# Altium schematic sheet EthernetSheet.SchDoc
size B; SheetNumber: 13; SheetTotal: 14
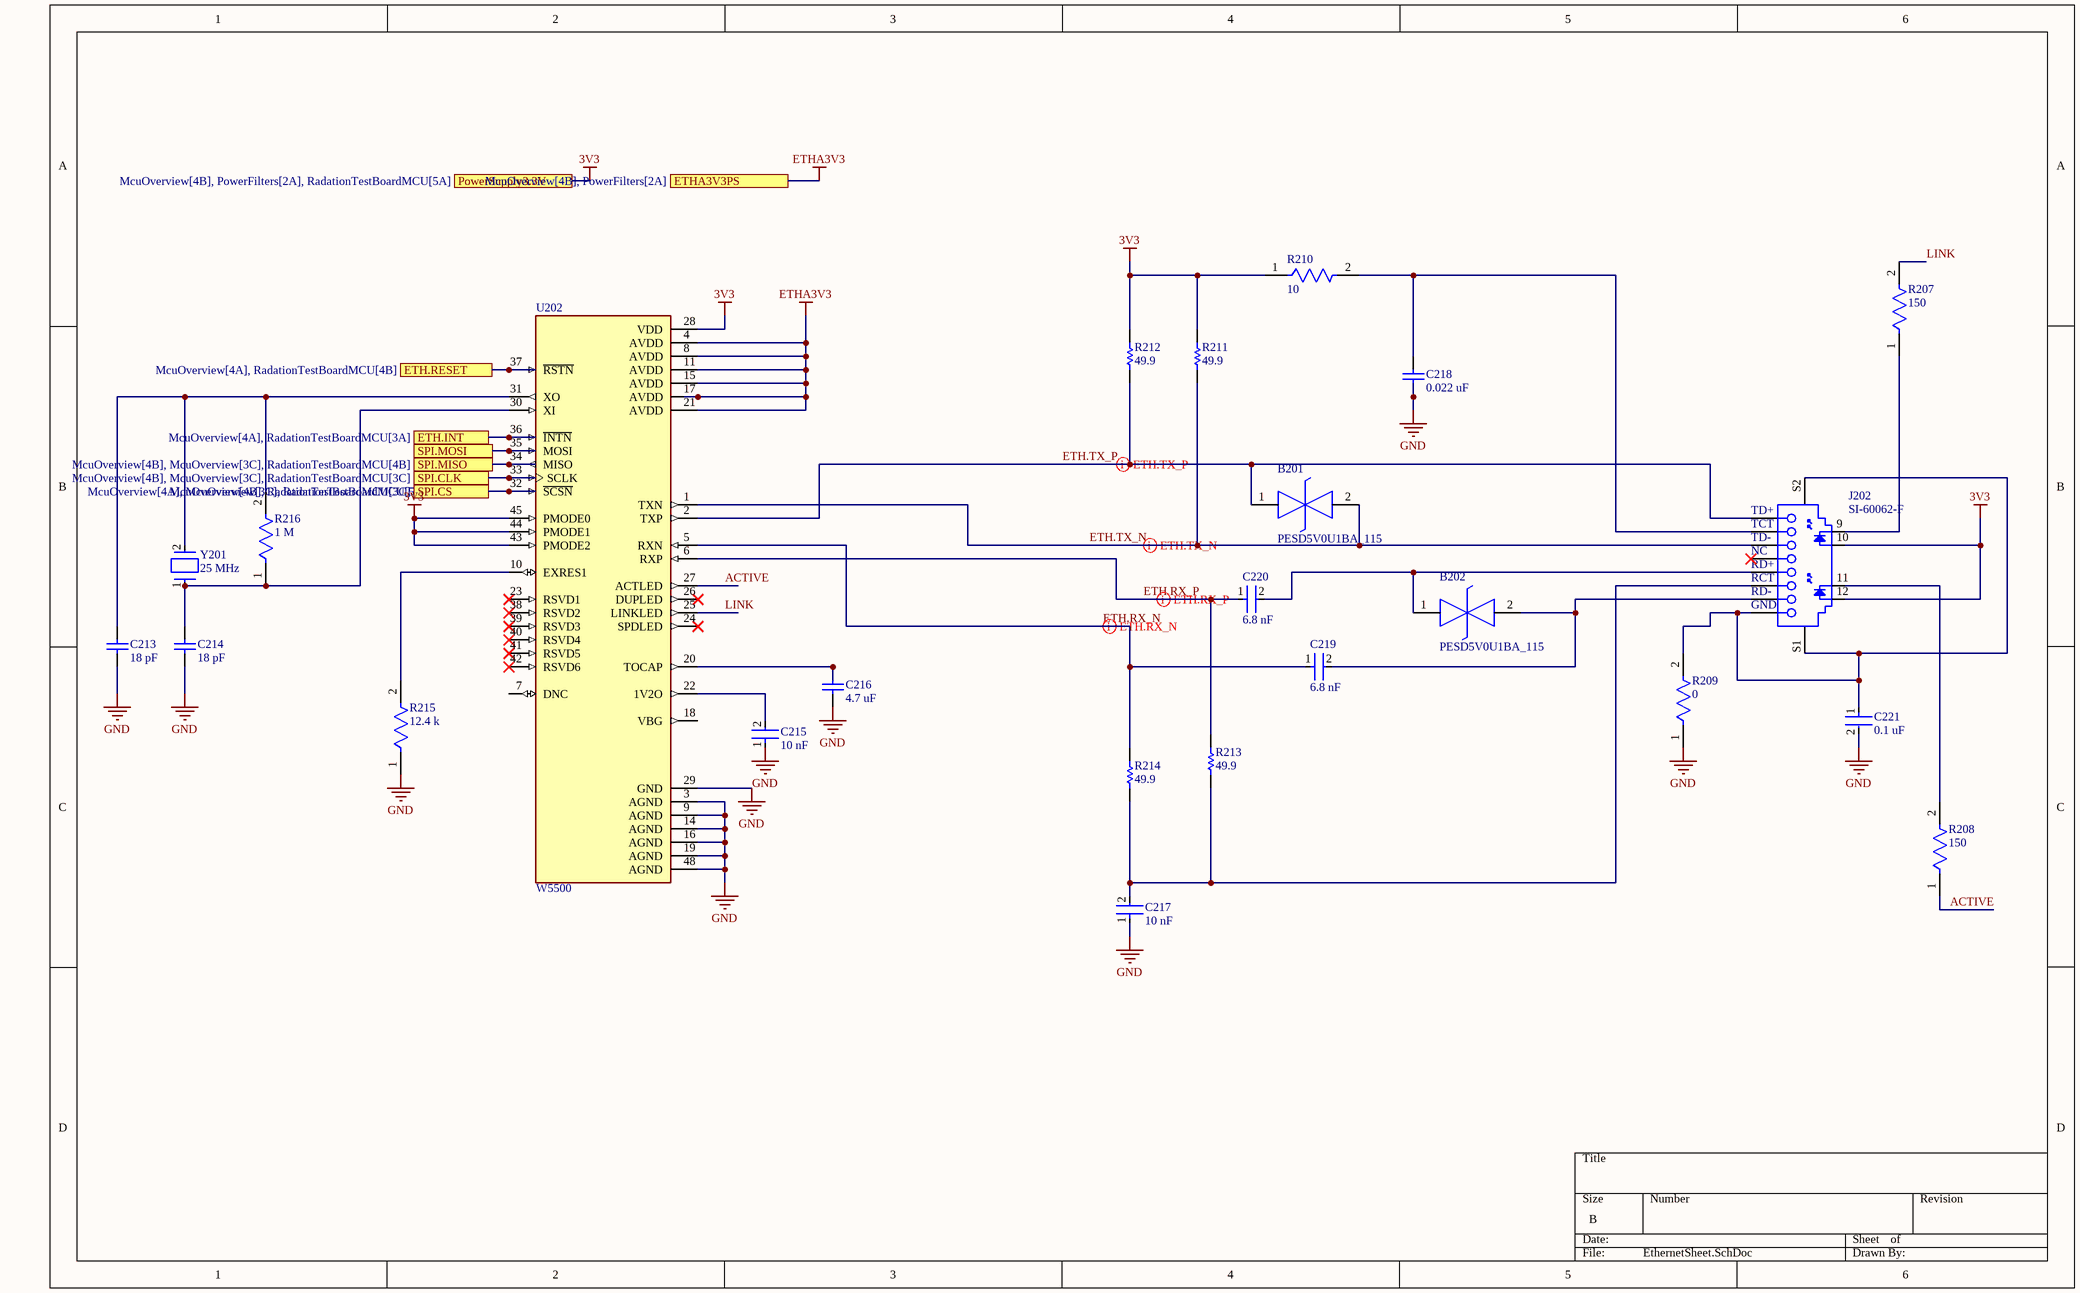
[diagram p0: EthernetSheet.SchDoc]

## Parts
B201  PESD5V0U1BA_115  [PESD5V0U1BA115]
B202  PESD5V0U1BA_115  [PESD5V0U1BA115]
C213  18 pF  [CAPC1608X90X35LL15T15]
C214  18 pF  [CAPC1608X90X35LL15T15]
C215  10 nF  [FP-0603-L_1_6_0_15-W_0_81-IPC_C]
C216  4.7 uF  [CAPC1608X87X35NL15T15]
C217  10 nF  [FP-0603-L_1_6_0_15-W_0_81-IPC_C]
C218  0.022 uF  [CAPC1608X92X38LL15T08]
C219  6.8 nF  [FP-CGA3E-0_3-0_1-IPC_A]
C220  6.8 nF  [FP-CGA3E-0_3-0_1-IPC_A]
C221  0.1 uF  [FP-CC0603-DA-IPC_A]
J202  SI-60062-F  [BELF-SI-60062-F_V]
R207  150  [FP-CRCW0603-e3-MFG]
R208  150  [FP-CRCW0603-e3-MFG]
R209  0  [FP-CRCW0402-e3-IPC_C]
R210  10  [FP-CRCW0603-e3-IPC_A]
R211  49.9  [RESC1609X50X30NL10T20]
R212  49.9  [RESC1609X50X30NL10T20]
R213  49.9  [RESC1609X50X30NL10T20]
R214  49.9  [RESC1609X50X30NL10T20]
R215  12.4 k  [FP-CRCW0603-e3-IPC_B]
R216  1 M  [FP-ERJ3EK-IPC_C]
U202  W5500  [QFP50P900X900X160-48N]
Y201  25 MHz  [FP-ABM3-MFG]

## Ports
ETH.INT (see McuOverview[4A], RadationTestBoardMCU[3A]), ETH.RESET (see McuOverview[4A], RadationTestBoardMCU[4B]), ETHA3V3PS (see McuOverview[4B], PowerFilters[2A]), PowerSupply3.3V (see McuOverview[4B], PowerFilters[2A], RadationTestBoardMCU[5A]), SPI.CLK (see McuOverview[4B], McuOverview[3C], RadationTestBoardMCU[3C]), SPI.CS (see McuOverview[4B], RadationTestBoardMCU[3C]), SPI.MISO (see McuOverview[4B], McuOverview[3C], RadationTestBoardMCU[4B]), SPI.MOSI (see McuOverview[4A], McuOverview[3C], RadationTestBoardMCU[5B])

## Nets
3V3: J202.10 J202.12 R210.1 R211.2 R212.2 U202.28(VDD) U202.43(PMODE2) U202.44(PMODE1) U202.45(PMODE0) ; port PowerSupply3.3V
ETHA3V3: U202.4(AVDD) U202.8(AVDD) U202.11(AVDD) U202.15(AVDD) U202.17(AVDD) U202.21(AVDD) ; port ETHA3V3PS
GND: C213.2 C214.1 C215.1 C216.1 C217.1 C218.1 C221.2 R209.1 R215.1 U202.3(AGND) U202.9(AGND) U202.14(AGND) U202.16(AGND) U202.19(AGND) U202.29(GND) U202.48(AGND)
ACTIVE: R208.1 U202.27(ACTLED)
ETH.INT: U202.36(~{INTN}) ; port ETH.INT
ETH.RESET: U202.37(~{RSTN}) ; port ETH.RESET
ETH.RX_N: C219.1 R214.2 U202.5(RXN)
ETH.RX_P: C220.1 R213.2 U202.6(RXP)
ETH.TX_N: B201.2(K2) J202.3(TD-) R211.1 U202.1(TXN)
ETH.TX_P: B201.1(K1) J202.1(TD+) R212.1 U202.2(TXP)
LINK: R207.2 U202.25(LINKLED)
SPI.CLK: U202.33(SCLK) ; port SPI.CLK
SPI.CS: U202.32(~{SCSN}) ; port SPI.CS
SPI.MISO: U202.34(MISO) ; port SPI.MISO
SPI.MOSI: U202.35(MOSI) ; port SPI.MOSI
NetB202_1: B202.1(K1) C220.2 J202.5(RD+)
NetB202_2: B202.2(K2) C219.2 J202.7(RD-)
NetC213_1: C213.1 R216.2 U202.31(XO) Y201.2
NetC214_2: C214.2 R216.1 U202.30(XI) Y201.1
NetC215_2: C215.2 U202.22(1V2O)
NetC216_2: C216.2 U202.20(TOCAP)
NetC217_2: C217.2 J202.6(RCT) R213.1 R214.1
NetC218_2: C218.2 J202.2(TCT) R210.2
NetC221_1: C221.1 J202.8(GND) J202.S1 J202.S2 R209.2
NetJ202_9: J202.9 R207.1
NetJ202_11: J202.11 R208.2
NetR215_2: R215.2 U202.10(EXRES1)

Not connected (* = marked no-connect by the designer): J202 4(NC)*; U202 7(DNC) 18(VBG) 23(RSVD1)* 24(SPDLED)* 26(DUPLED)* 38(RSVD2)* 39(RSVD3)* 40(RSVD4)* 41(RSVD5)* 42(RSVD6)*

## Layout directives
differential pair: ETH.RX_N, ETH.RX_P, ETH.TX_N, ETH.TX_P

## Library data of the parts
B201 B202 = PESD5V0U1BA_115: PESDV0U1BA - Low capacitance bidirectional ESD protection diode; Manufacturer_Name: Nexperia; Manufacturer_Part_Number: PESD5V0U1BA,115; Geometry.Height: 1.1mm; Mouser Part Number: 771-PESD5V0U1BA115; Mouser Price/Stock: https://www.mouser.co.uk/ProductDetail/Nexperia/PESD5V0U1BA115?qs=LOCUfHb8d9tqw6h%2FD3HZHw%3D%3D; Datasheet Link: https://assets.nexperia.com/documents/data-sheet/PESD5V0U1BA.pdf
C213 C214 = CMP-2006-04592-1: 06035A180FAT2A; Manufacturer: AVX Interconnect / Elco; Part Number: 06035A180FAT2A
C215 C217 = CMP-2006-02076-2: CAP CER 10000PF 50V X7R 0603 06035C103KAT4A; Insulation Resistance: 100GR; Tolerance: 10%; Dissipation Factor: 2.5%; Capacitance: 10nF; Number of Pins: 2; Package Quantity: 15000; Voltage Rating (DC): 50V; Case Code (Imperial): 0603; Series: -; Depth: 0.81mm; Termination: SMD/SMT; Packaging: Tape and Reel; Length: 1.6mm; Radiation Hardening: No; REACH SVHC: No SVHC; Height: 0.9mm; Min Operating Temperature: -55°C; Voltage Rating: 50V; RoHS Compliant: Yes; Case Code (Metric): 1608; Width: 0.81mm; Lead Free: Lead Free; Construction: Flat; Case/Package: 0603; Voltage: 50V; Dielectric: X7R; Max Operating Temperature: 125°C; Mount: Surface Mount
C216 = CMP-2006-03238-1: C0603C475K8PACTU; Manufacturer: Kemet; Part Number: C0603C475K8PACTU
C218 = CMP-2006-01328-1: VJ0603Y223JXAAC; Manufacturer: Vitramon; Part Number: VJ0603Y223JXAAC
C219 C220 = CMP-08246-001772-1: Cap Ceramic 6.8nF 50V C0G 5% Pad SMD 0603 +125°C Automotive T/R CGA3E2C0G1H682J080AE
C221 = CMP-03422-001490-1: CAP CER 0.1UF 50V X7R 0603 CC0603JRX7R9BB104; Capacitance: 100nF; Tolerance: 5%; Number of Pins: 2; Depth: 0.8mm; Weight: 7.1E-05oz; Radiation Hardening: No; Case Code (Metric): 1608; Dielectric: X7R; Max Operating Temperature: 125°C; Voltage Rating (DC): 50V; Case/Package: 0603; Halogen Free: Halogen Free; Mount: Surface Mount; Lead Free: Lead Free; Termination: SMD/SMT; RoHS Compliant: Yes; Length: 1.6mm; Series: CC; Resistor Type: Ceramic; Case Code (Imperial): 0603; Construction: Flat; Width: 0.031inch; Height: 0.8mm; Voltage Rating: 50V; Min Operating Temperature: -55°C; Thickness: 0.035inch; Packaging: Tape and Reel
J202 = CMP-2000-07059-1: 1 Port RJ45 Magjack Connector with Yellow and Green LED, 10/100 Base-T, 12-Pin THD, RoHS, Tray; Manufacturer: Bel Fuse; Number of Ways: 8P4C; Gender: Female; Shield Type: STP; Connector Type: RJ45; Contact Plating: Gold; Mounting Type: ThroughHole; Datasheet Version: Rev. B0, 09/2008; Package Reference: SI-60062-F; Manufacturer URL: http://belfuse.com/; Package Description: 12-Pin Through Hole Device, Body 21.59 x 16.13 mm; Series: MagJack; Contact Material: CopperAlloy; Datasheet URL: http://belfuse.com/pdfs/SI-60062-F.pdf; Width: 17.98mm; Length: 15.21mm; Mounting Technology: ThroughHole; Depth: 21.59mm; Orientation: Straight
R207 R208 = CMP-2000-03913-2: RES Thick Film, 150Ω, 1%, 0.1W, 100ppm/°C, 0603 CRCW0603150RFKEA; Voltage Rating (DC): 75V; Resistance: 150R; Max Power Dissipation: 100mW; Features: Automotive AEC-Q200; Weight: 7.1E-05oz; Number of Terminations: 2; Temperature Coefficient: 100ppm/°C; Military Standard: Not; Length: 1.55mm; Min Operating Temperature: -55°C; Termination: SMD/SMT; Tolerance: 1%; Composition: Thick Film; Depth: 0.85mm; Max Operating Temperature: 155°C; Width: 0.033inch; Lead Free: Lead Free; Height: 0.45mm; Case Code (Metric): 1608; Package Quantity: 10; Case Code (Imperial): 0603; Voltage Rating: 75V; Radiation Hardening: No; Contact Plating: Tin; Mount: Surface Mount; Packaging: Tape and Reel; Power Rating: 100mW; Case/Package: 0603
R209 = CMP-2002-08122-2: RES Thick Film, 0Ω, 0.063W, 0402 CRCW04020000Z0ED; Tolerance: 5%; Max Power Dissipation: 63mW; Voltage Rating: 50V; Temperature Coefficient: 100ppm/°C; Resistance: 0mR; Contact Plating: Tin; Height: 0.35mm; Radiation Hardening: No; Features: Automotive AEC-Q200; Composition: Thick Film; Width: 0.5mm; Weight: 2.3E-05oz; Termination: SMD/SMT; Packaging: Tape and Reel; Mount: Surface Mount; Case Code (Metric): 1005; Military Standard: Not; Min Operating Temperature: -55°C; Number of Terminations: 2; Package Quantity: 1; Case Code (Imperial): 0402; Depth: 0.5mm; Max Operating Temperature: 155°C; Case/Package: 0402; Power Rating: 63mW; Lead Free: Lead Free; Voltage Rating (DC): 50V; Length: 1mm
R210 = CMP-2000-03845-2: RES Thick Film, 10Ω, 1%, 0.1W, 100ppm/°C, 0603 CRCW060310R0FKEA; Resistance: 10R; Voltage Rating (DC): 75V; Power Rating: 100mW; Depth: 0.85mm; Height: 0.45mm; Package Quantity: 10; Temperature Coefficient: 100ppm/°C; Weight: 7.1E-05oz; Case Code (Metric): 1608; Number of Terminations: 2; Features: Automotive AEC-Q200; Termination: SMD/SMT; Lead Free: Lead Free; Mount: Surface Mount; Number of Pins: 2; Tolerance: 1%; Max Power Dissipation: 100mW; Width: 0.033inch; Contact Plating: Tin; Case Code (Imperial): 0603; Max Operating Temperature: 155°C; Min Operating Temperature: -55°C; Voltage Rating: 75V; Length: 1.55mm; Case/Package: 0603; Composition: Thick Film; Packaging: Tape and Reel; Military Standard: Not
R211-R214 = CMP-2000-03399-1: CRCW060349R9FKEC 0603 49.9 ohm Resistor; Manufacturer: Vishay Dale; Part Number: CRCW060349R9FKEC
R215 = CMP-2000-03881-2: RES Thick Film, 12.4kΩ, 1%, 0.1W, 100ppm/°C, 0603 CRCW060312K4FKEA; Voltage Rating (DC): 75V; Resistance: 12.4kR; Power Rating: 100mW; Case Code (Metric): 1608; Contact Plating: Tin; Radiation Hardening: No; Packaging: Tape and Reel; Lead Free: Lead Free; Length: 1.55mm; Depth: 0.85mm; Width: 0.85mm; Package Quantity: 10; Composition: Thick Film; Number of Terminations: 2; Max Operating Temperature: 155°C; Min Operating Temperature: -55°C; Height: 0.45mm; Tolerance: 1%; Temperature Coefficient: 100ppm/°C; Number of Pins: 2; Case Code (Imperial): 0603; Features: Automotive AEC-Q200; Weight: 7.1E-05oz; Max Power Dissipation: 100mW; Voltage Rating: 75V; Military Standard: Not; Termination: SMD/SMT; Mount: Surface Mount; Case/Package: 0603
R216 = CMP-1012-00849-3: RES SMD 1M OHM 1% 1/10W 0603 ERJ-3EKF1004V; Resistance: 1MR; Voltage Rating: 75V; Temperature Coefficient: 100ppm/°C; Power Rating: 100mW; REACH SVHC: No SVHC; Radiation Hardening: No; Features: Automotive AEC-Q200; Case Code (Metric): 1608; Resistance Tolerance: 1%; Case/Package: 0603; Termination: SMD/SMT; Max Operating Temperature: 155°C; Tolerance: 1%; Size Code: 0603; Case Code (Imperial): 0603; Min Operating Temperature: -55°C; Number of Pins: 2; Mount: Surface Mount; Package Quantity: 1; Military Standard: Not; Voltage Rating (DC): 75V; Depth: 0.8mm; Packaging: Tape and Reel; Width: 0.8mm; Number of Terminations: 2; Length: 1.6mm; Height: 0.022inch; RoHS Compliant: Yes; Resistor Type: Thick Film; Contact Plating: Tin; Lead Free: Lead Free; Series: ERJ; Construction: Rectangular; Max Power Dissipation: 100mW
U202 = W5500: Hardwired TCP/IP embedded Ethernet controller; Availability: Unavailable; MP: W5500; Value: *; Price: None; Package: None
Y201 = CMP-2000-05729-2: Crystal 25MHz ±20ppm 18pF SMD-2 5mm x 3.2mm ABM3-25.000MHZ-B2-T; Insulation Resistance: 500MR; Frequency Stability: 50ppm; ESR (Equivalent Series Resistance): 30R; Operating Frequency: 25 MHz; Termination: SMD/SMT; REACH SVHC: Yes; Max Operating Temperature: 70°C; Packaging: Tape and Reel; Tolerance: 20ppm; Load Capacitance: 18pF; Depth: 3.2mm; Height: 0.051inch; Min Operating Temperature: -20°C; Length: 5mm; Mount: Surface Mount; Resistor Type: Ceramic; Width: 0.126inch; Case/Package: CSMD; Frequency Tolerance: 20ppm; Package Quantity: 1000; Number of Pins: 2; RoHS Compliant: Yes; Frequency: 25MHz; Series Resistance: 30R; Series: ABM3; Lead Free: Lead Free